# Altium schematic sheet 1_the important stuff.schdoc
size 604 x 431 mm; Symbol: Sheet-Symbol_A4; Device: Sheet-Symbol_A4; Company: Quarterpie; Drawed: Prash; Reviewed: Prash; Version: V1.2; Page Size: A4; @Project Name: URC merc keyboard; @Page Count: 2; @Update Date: 2024-08-09; @Create Date: 2023-04-20; @Schematic Name: Schematic1; Part Number: URC75; @Page No: 1; @Page Name: the important stuff
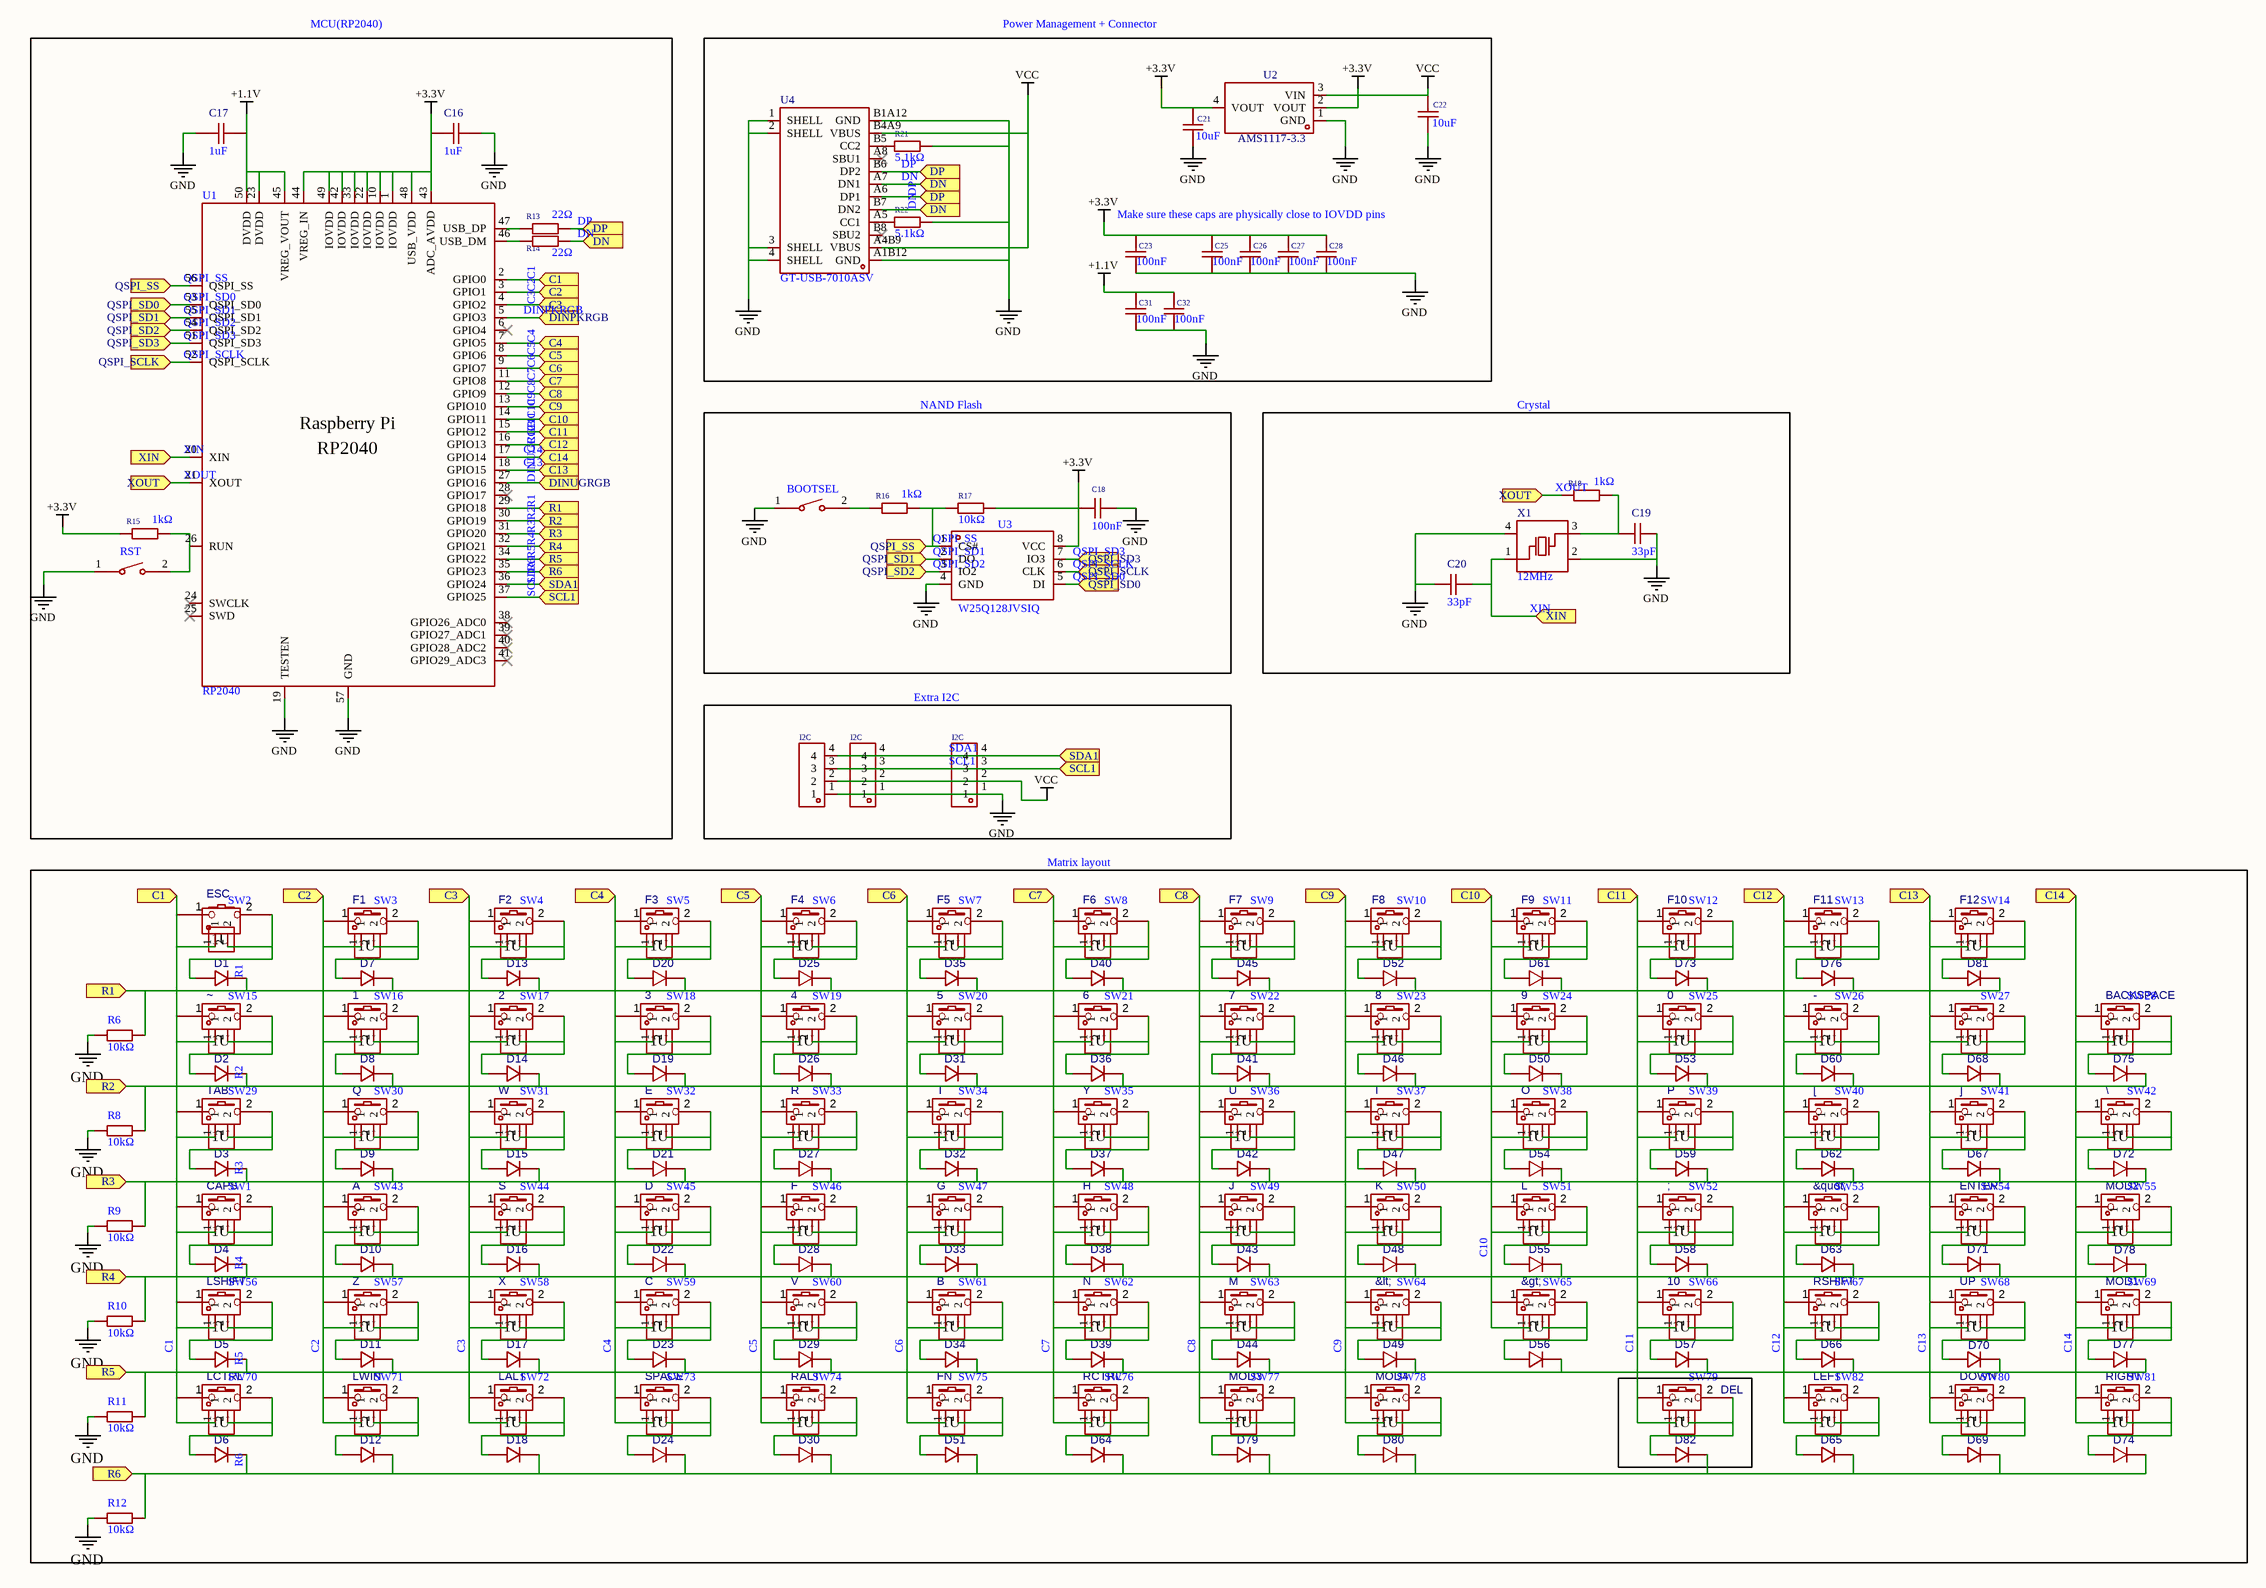
[diagram p0: 1_the important stuff.schdoc]

## Parts
(Parts that share a designator on the sheet are numbered #1, #2 ... from top to bottom, then left to right.)
0  CHERRY-MX-SW-1U  [CHERRY-MX-PCB-1U]  (value not drawn)
1  CHERRY-MX-SW-1U  [CHERRY-MX-PCB-1U]  (value not drawn)
2  CHERRY-MX-SW-1U  [CHERRY-MX-PCB-1U]  (value not drawn)
3  CHERRY-MX-SW-1U  [CHERRY-MX-PCB-1U]  (value not drawn)
4  CHERRY-MX-SW-1U  [CHERRY-MX-PCB-1U]  (value not drawn)
5  CHERRY-MX-SW-1U  [CHERRY-MX-PCB-1U]  (value not drawn)
6  CHERRY-MX-SW-1U  [CHERRY-MX-PCB-1U]  (value not drawn)
7  CHERRY-MX-SW-1U  [CHERRY-MX-PCB-1U]  (value not drawn)
8  CHERRY-MX-SW-1U  [CHERRY-MX-PCB-1U]  (value not drawn)
9  CHERRY-MX-SW-1U  [CHERRY-MX-PCB-1U]  (value not drawn)
10  CHERRY-MX-SW-1U  [CHERRY-MX-PCB-1U]  (value not drawn)
&gt;  CHERRY-MX-SW-1U  [CHERRY-MX-PCB-1U]  (value not drawn)
&lt;  CHERRY-MX-SW-1U  [CHERRY-MX-PCB-1U]  (value not drawn)
&quot;  CHERRY-MX-SW-1U  [CHERRY-MX-PCB-1U]  (value not drawn)
-  CHERRY-MX-SW-1U  [CHERRY-MX-PCB-1U]  (value not drawn)
;  CHERRY-MX-SW-1U  [CHERRY-MX-PCB-1U]  (value not drawn)
?  CHERRY-MX-SW-1U  [CHERRY-MX-PCB-1U]  (value not drawn)
[  CHERRY-MX-SW-1U  [CHERRY-MX-PCB-1U]  (value not drawn)
\  CHERRY-MX-SW-1U  [CHERRY-MX-PCB-1U]  (value not drawn)
]  CHERRY-MX-SW-1U  [CHERRY-MX-PCB-1U]  (value not drawn)
A  CHERRY-MX-SW-1U  [CHERRY-MX-PCB-1U]  (value not drawn)
B  CHERRY-MX-SW-1U  [CHERRY-MX-PCB-1U]  (value not drawn)
BACKSPACE  CHERRY-MX-SW-1U  [CHERRY-MX-PCB-1U]  (value not drawn)
BOOTSEL  TS-1088-AR02016  [SW-SMD_L3.9-W3.0-P4.45]  (value not drawn)
C  CHERRY-MX-SW-1U  [CHERRY-MX-PCB-1U]  (value not drawn)
C16  1uF  [C0402]
C17  1uF  [C0402]
C18  100nF  [C0402]
C19  33pF  [C0402]
C20  33pF  [C0402]
C21  10uF  [C0402]
C22  10uF  [C0402]
C23  100nF  [C0402]
C25  100nF  [C0402]
C26  100nF  [C0402]
C27  100nF  [C0402]
C28  100nF  [C0402]
C31  100nF  [C0402]
C32  100nF  [C0402]
CAPS  CHERRY-MX-SW-1U  [CHERRY-MX-PCB-1U]  (value not drawn)
D  CHERRY-MX-SW-1U  [CHERRY-MX-PCB-1U]  (value not drawn)
D1  1N4148_C14538  [DO-35_BD2.0-L4.2-P8.20-D0.5-RD]  (value not drawn)
D2  1N4148_C14538  [DO-35_BD2.0-L4.2-P8.20-D0.5-RD]  (value not drawn)
D3  1N4148_C14538  [DO-35_BD2.0-L4.2-P8.20-D0.5-RD]  (value not drawn)
D4  1N4148_C14538  [DO-35_BD2.0-L4.2-P8.20-D0.5-RD]  (value not drawn)
D5  1N4148_C14538  [DO-35_BD2.0-L4.2-P8.20-D0.5-RD]  (value not drawn)
D6  1N4148_C14538  [DO-35_BD2.0-L4.2-P8.20-D0.5-RD]  (value not drawn)
D7  1N4148_C14538  [DO-35_BD2.0-L4.2-P8.20-D0.5-RD]  (value not drawn)
D8  1N4148_C14538  [DO-35_BD2.0-L4.2-P8.20-D0.5-RD]  (value not drawn)
D9  1N4148_C14538  [DO-35_BD2.0-L4.2-P8.20-D0.5-RD]  (value not drawn)
D10  1N4148_C14538  [DO-35_BD2.0-L4.2-P8.20-D0.5-RD]  (value not drawn)
D11  1N4148_C14538  [DO-35_BD2.0-L4.2-P8.20-D0.5-RD]  (value not drawn)
D12  1N4148_C14538  [DO-35_BD2.0-L4.2-P8.20-D0.5-RD]  (value not drawn)
D13  1N4148_C14538  [DO-35_BD2.0-L4.2-P8.20-D0.5-RD]  (value not drawn)
D14  1N4148_C14538  [DO-35_BD2.0-L4.2-P8.20-D0.5-RD]  (value not drawn)
D15  1N4148_C14538  [DO-35_BD2.0-L4.2-P8.20-D0.5-RD]  (value not drawn)
D16  1N4148_C14538  [DO-35_BD2.0-L4.2-P8.20-D0.5-RD]  (value not drawn)
D17  1N4148_C14538  [DO-35_BD2.0-L4.2-P8.20-D0.5-RD]  (value not drawn)
D18  1N4148_C14538  [DO-35_BD2.0-L4.2-P8.20-D0.5-RD]  (value not drawn)
D19  1N4148_C14538  [DO-35_BD2.0-L4.2-P8.20-D0.5-RD]  (value not drawn)
D20  1N4148_C14538  [DO-35_BD2.0-L4.2-P8.20-D0.5-RD]  (value not drawn)
D21  1N4148_C14538  [DO-35_BD2.0-L4.2-P8.20-D0.5-RD]  (value not drawn)
D22  1N4148_C14538  [DO-35_BD2.0-L4.2-P8.20-D0.5-RD]  (value not drawn)
D23  1N4148_C14538  [DO-35_BD2.0-L4.2-P8.20-D0.5-RD]  (value not drawn)
D24  1N4148_C14538  [DO-35_BD2.0-L4.2-P8.20-D0.5-RD]  (value not drawn)
D25  1N4148_C14538  [DO-35_BD2.0-L4.2-P8.20-D0.5-RD]  (value not drawn)
D26  1N4148_C14538  [DO-35_BD2.0-L4.2-P8.20-D0.5-RD]  (value not drawn)
D27  1N4148_C14538  [DO-35_BD2.0-L4.2-P8.20-D0.5-RD]  (value not drawn)
D28  1N4148_C14538  [DO-35_BD2.0-L4.2-P8.20-D0.5-RD]  (value not drawn)
D29  1N4148_C14538  [DO-35_BD2.0-L4.2-P8.20-D0.5-RD]  (value not drawn)
D30  1N4148_C14538  [DO-35_BD2.0-L4.2-P8.20-D0.5-RD]  (value not drawn)
D31  1N4148_C14538  [DO-35_BD2.0-L4.2-P8.20-D0.5-RD]  (value not drawn)
D32  1N4148_C14538  [DO-35_BD2.0-L4.2-P8.20-D0.5-RD]  (value not drawn)
D33  1N4148_C14538  [DO-35_BD2.0-L4.2-P8.20-D0.5-RD]  (value not drawn)
D34  1N4148_C14538  [DO-35_BD2.0-L4.2-P8.20-D0.5-RD]  (value not drawn)
D35  1N4148_C14538  [DO-35_BD2.0-L4.2-P8.20-D0.5-RD]  (value not drawn)
D36  1N4148_C14538  [DO-35_BD2.0-L4.2-P8.20-D0.5-RD]  (value not drawn)
D37  1N4148_C14538  [DO-35_BD2.0-L4.2-P8.20-D0.5-RD]  (value not drawn)
D38  1N4148_C14538  [DO-35_BD2.0-L4.2-P8.20-D0.5-RD]  (value not drawn)
D39  1N4148_C14538  [DO-35_BD2.0-L4.2-P8.20-D0.5-RD]  (value not drawn)
D40  1N4148_C14538  [DO-35_BD2.0-L4.2-P8.20-D0.5-RD]  (value not drawn)
D41  1N4148_C14538  [DO-35_BD2.0-L4.2-P8.20-D0.5-RD]  (value not drawn)
D42  1N4148_C14538  [DO-35_BD2.0-L4.2-P8.20-D0.5-RD]  (value not drawn)
D43  1N4148_C14538  [DO-35_BD2.0-L4.2-P8.20-D0.5-RD]  (value not drawn)
D44  1N4148_C14538  [DO-35_BD2.0-L4.2-P8.20-D0.5-RD]  (value not drawn)
D45  1N4148_C14538  [DO-35_BD2.0-L4.2-P8.20-D0.5-RD]  (value not drawn)
D46  1N4148_C14538  [DO-35_BD2.0-L4.2-P8.20-D0.5-RD]  (value not drawn)
D47  1N4148_C14538  [DO-35_BD2.0-L4.2-P8.20-D0.5-RD]  (value not drawn)
D48  1N4148_C14538  [DO-35_BD2.0-L4.2-P8.20-D0.5-RD]  (value not drawn)
D49  1N4148_C14538  [DO-35_BD2.0-L4.2-P8.20-D0.5-RD]  (value not drawn)
D50  1N4148_C14538  [DO-35_BD2.0-L4.2-P8.20-D0.5-RD]  (value not drawn)
D51  1N4148_C14538  [DO-35_BD2.0-L4.2-P8.20-D0.5-RD]  (value not drawn)
D52  1N4148_C14538  [DO-35_BD2.0-L4.2-P8.20-D0.5-RD]  (value not drawn)
D53  1N4148_C14538  [DO-35_BD2.0-L4.2-P8.20-D0.5-RD]  (value not drawn)
D54  1N4148_C14538  [DO-35_BD2.0-L4.2-P8.20-D0.5-RD]  (value not drawn)
D55  1N4148_C14538  [DO-35_BD2.0-L4.2-P8.20-D0.5-RD]  (value not drawn)
D56  1N4148_C14538  [DO-35_BD2.0-L4.2-P8.20-D0.5-RD]  (value not drawn)
D57  1N4148_C14538  [DO-35_BD2.0-L4.2-P8.20-D0.5-RD]  (value not drawn)
D58  1N4148_C14538  [DO-35_BD2.0-L4.2-P8.20-D0.5-RD]  (value not drawn)
D59  1N4148_C14538  [DO-35_BD2.0-L4.2-P8.20-D0.5-RD]  (value not drawn)
D60  1N4148_C14538  [DO-35_BD2.0-L4.2-P8.20-D0.5-RD]  (value not drawn)
D61  1N4148_C14538  [DO-35_BD2.0-L4.2-P8.20-D0.5-RD]  (value not drawn)
D62  1N4148_C14538  [DO-35_BD2.0-L4.2-P8.20-D0.5-RD]  (value not drawn)
D63  1N4148_C14538  [DO-35_BD2.0-L4.2-P8.20-D0.5-RD]  (value not drawn)
D64  1N4148_C14538  [DO-35_BD2.0-L4.2-P8.20-D0.5-RD]  (value not drawn)
D65  1N4148_C14538  [DO-35_BD2.0-L4.2-P8.20-D0.5-RD]  (value not drawn)
D66  1N4148_C14538  [DO-35_BD2.0-L4.2-P8.20-D0.5-RD]  (value not drawn)
D67  1N4148_C14538  [DO-35_BD2.0-L4.2-P8.20-D0.5-RD]  (value not drawn)
D68  1N4148_C14538  [DO-35_BD2.0-L4.2-P8.20-D0.5-RD]  (value not drawn)
D69  1N4148_C14538  [DO-35_BD2.0-L4.2-P8.20-D0.5-RD]  (value not drawn)
D70  1N4148_C14538  [DO-35_BD2.0-L4.2-P8.20-D0.5-RD]  (value not drawn)
D71  1N4148_C14538  [DO-35_BD2.0-L4.2-P8.20-D0.5-RD]  (value not drawn)
D72  1N4148_C14538  [DO-35_BD2.0-L4.2-P8.20-D0.5-RD]  (value not drawn)
D73  1N4148_C14538  [DO-35_BD2.0-L4.2-P8.20-D0.5-RD]  (value not drawn)
D74  1N4148_C14538  [DO-35_BD2.0-L4.2-P8.20-D0.5-RD]  (value not drawn)
D75  1N4148_C14538  [DO-35_BD2.0-L4.2-P8.20-D0.5-RD]  (value not drawn)
D76  1N4148_C14538  [DO-35_BD2.0-L4.2-P8.20-D0.5-RD]  (value not drawn)
D77  1N4148_C14538  [DO-35_BD2.0-L4.2-P8.20-D0.5-RD]  (value not drawn)
D78  1N4148_C14538  [DO-35_BD2.0-L4.2-P8.20-D0.5-RD]  (value not drawn)
D79  1N4148_C14538  [DO-35_BD2.0-L4.2-P8.20-D0.5-RD]  (value not drawn)
D80  1N4148_C14538  [DO-35_BD2.0-L4.2-P8.20-D0.5-RD]  (value not drawn)
D81  1N4148_C14538  [DO-35_BD2.0-L4.2-P8.20-D0.5-RD]  (value not drawn)
D82  1N4148_C14538  [DO-35_BD2.0-L4.2-P8.20-D0.5-RD]  (value not drawn)
DEL  CHERRY-MX-SW-1U  [CHERRY-MX-PCB-1U]  (value not drawn)
DOWN  CHERRY-MX-SW-1U  [CHERRY-MX-PCB-1U]  (value not drawn)
E  CHERRY-MX-SW-1U  [CHERRY-MX-PCB-1U]  (value not drawn)
ENTER  CHERRY-MX-SW-1U  [CHERRY-MX-PCB-1U]  (value not drawn)
ESC  CHERRY-MX-SW-1U  [CHERRY-MX-PCB-1U]  (value not drawn)
F  CHERRY-MX-SW-1U  [CHERRY-MX-PCB-1U]  (value not drawn)
F1  CHERRY-MX-SW-1U  [CHERRY-MX-PCB-1U]  (value not drawn)
F2  CHERRY-MX-SW-1U  [CHERRY-MX-PCB-1U]  (value not drawn)
F3  CHERRY-MX-SW-1U  [CHERRY-MX-PCB-1U]  (value not drawn)
F4  CHERRY-MX-SW-1U  [CHERRY-MX-PCB-1U]  (value not drawn)
F5  CHERRY-MX-SW-1U  [CHERRY-MX-PCB-1U]  (value not drawn)
F6  CHERRY-MX-SW-1U  [CHERRY-MX-PCB-1U]  (value not drawn)
F7  CHERRY-MX-SW-1U  [CHERRY-MX-PCB-1U]  (value not drawn)
F8  CHERRY-MX-SW-1U  [CHERRY-MX-PCB-1U]  (value not drawn)
F9  CHERRY-MX-SW-1U  [CHERRY-MX-PCB-1U]  (value not drawn)
F10  CHERRY-MX-SW-1U  [CHERRY-MX-PCB-1U]  (value not drawn)
F11  CHERRY-MX-SW-1U  [CHERRY-MX-PCB-1U]  (value not drawn)
F12  CHERRY-MX-SW-1U  [CHERRY-MX-PCB-1U]  (value not drawn)
FN  CHERRY-MX-SW-1U  [CHERRY-MX-PCB-1U]  (value not drawn)
G  CHERRY-MX-SW-1U  [CHERRY-MX-PCB-1U]  (value not drawn)
H  CHERRY-MX-SW-1U  [CHERRY-MX-PCB-1U]  (value not drawn)
I  CHERRY-MX-SW-1U  [CHERRY-MX-PCB-1U]  (value not drawn)
I2C#1  PZ254V-11-04P  [HDR-TH_4P-P2.54-V-M]  (value not drawn)
I2C#2  PZ254V-11-04P  [HDR-TH_4P-P2.54-V-M]  (value not drawn)
I2C#3  PZ254V-11-04P  [HDR-TH_4P-P2.54-V-M]  (value not drawn)
J  CHERRY-MX-SW-1U  [CHERRY-MX-PCB-1U]  (value not drawn)
K  CHERRY-MX-SW-1U  [CHERRY-MX-PCB-1U]  (value not drawn)
L  CHERRY-MX-SW-1U  [CHERRY-MX-PCB-1U]  (value not drawn)
LALT  CHERRY-MX-SW-1U  [CHERRY-MX-PCB-1U]  (value not drawn)
LCTRL  CHERRY-MX-SW-1U  [CHERRY-MX-PCB-1U]  (value not drawn)
LEFT  CHERRY-MX-SW-1U  [CHERRY-MX-PCB-1U]  (value not drawn)
LSHIFT  CHERRY-MX-SW-1U  [CHERRY-MX-PCB-1U]  (value not drawn)
LWIN  CHERRY-MX-SW-1U  [CHERRY-MX-PCB-1U]  (value not drawn)
M  CHERRY-MX-SW-1U  [CHERRY-MX-PCB-1U]  (value not drawn)
MOD1  CHERRY-MX-SW-1U  [CHERRY-MX-PCB-1U]  (value not drawn)
MOD2  CHERRY-MX-SW-1U  [CHERRY-MX-PCB-1U]  (value not drawn)
MOD3  CHERRY-MX-SW-1U  [CHERRY-MX-PCB-1U]  (value not drawn)
MOD4  CHERRY-MX-SW-1U  [CHERRY-MX-PCB-1U]  (value not drawn)
N  CHERRY-MX-SW-1U  [CHERRY-MX-PCB-1U]  (value not drawn)
O  CHERRY-MX-SW-1U  [CHERRY-MX-PCB-1U]  (value not drawn)
P  CHERRY-MX-SW-1U  [CHERRY-MX-PCB-1U]  (value not drawn)
Q  CHERRY-MX-SW-1U  [CHERRY-MX-PCB-1U]  (value not drawn)
R  CHERRY-MX-SW-1U  [CHERRY-MX-PCB-1U]  (value not drawn)
R6  10kΩ  [R0603]
R8  10kΩ  [R0603]
R9  10kΩ  [R0603]
R10  10kΩ  [R0603]
R11  10kΩ  [R0603]
R12  10kΩ  [R0603]
R13  22Ω  [R0402]
R14  22Ω  [R0402]
R15  1kΩ  [R0402]
R16  1kΩ  [R0402]
R17  10kΩ  [R0402]
R18  1kΩ  [R0402]
R21  5.1kΩ  [R0402]
R22  5.1kΩ  [R0402]
RALT  CHERRY-MX-SW-1U  [CHERRY-MX-PCB-1U]  (value not drawn)
RCTRL  CHERRY-MX-SW-1U  [CHERRY-MX-PCB-1U]  (value not drawn)
RIGHT  CHERRY-MX-SW-1U  [CHERRY-MX-PCB-1U]  (value not drawn)
RSHIFT  CHERRY-MX-SW-1U  [CHERRY-MX-PCB-1U]  (value not drawn)
RST  TS-1088-AR02016  [SW-SMD_L3.9-W3.0-P4.45]  (value not drawn)
S  CHERRY-MX-SW-1U  [CHERRY-MX-PCB-1U]  (value not drawn)
SPACE  CHERRY-MX-SW-1U  [CHERRY-MX-PCB-1U]  (value not drawn)
SW1  SW-5  [SW-SMD_KAILH-SOCKET_C9900019772]  (value not drawn)
SW2  SW-5  [SW-SMD_KAILH-SOCKET_C9900019772]  (value not drawn)
SW3  SW-5  [SW-SMD_KAILH-SOCKET_C9900019772]  (value not drawn)
SW4  SW-5  [SW-SMD_KAILH-SOCKET_C9900019772]  (value not drawn)
SW5  SW-5  [SW-SMD_KAILH-SOCKET_C9900019772]  (value not drawn)
SW6  SW-5  [SW-SMD_KAILH-SOCKET_C9900019772]  (value not drawn)
SW7  SW-5  [SW-SMD_KAILH-SOCKET_C9900019772]  (value not drawn)
SW8  SW-5  [SW-SMD_KAILH-SOCKET_C9900019772]  (value not drawn)
SW9  SW-5  [SW-SMD_KAILH-SOCKET_C9900019772]  (value not drawn)
SW10  SW-5  [SW-SMD_KAILH-SOCKET_C9900019772]  (value not drawn)
SW11  SW-5  [SW-SMD_KAILH-SOCKET_C9900019772]  (value not drawn)
SW12  SW-5  [SW-SMD_KAILH-SOCKET_C9900019772]  (value not drawn)
SW13  SW-5  [SW-SMD_KAILH-SOCKET_C9900019772]  (value not drawn)
SW14  SW-5  [SW-SMD_KAILH-SOCKET_C9900019772]  (value not drawn)
SW15  SW-5  [SW-SMD_KAILH-SOCKET_C9900019772]  (value not drawn)
SW16  SW-5  [SW-SMD_KAILH-SOCKET_C9900019772]  (value not drawn)
SW17  SW-5  [SW-SMD_KAILH-SOCKET_C9900019772]  (value not drawn)
SW18  SW-5  [SW-SMD_KAILH-SOCKET_C9900019772]  (value not drawn)
SW19  SW-5  [SW-SMD_KAILH-SOCKET_C9900019772]  (value not drawn)
SW20  SW-5  [SW-SMD_KAILH-SOCKET_C9900019772]  (value not drawn)
SW21  SW-5  [SW-SMD_KAILH-SOCKET_C9900019772]  (value not drawn)
SW22  SW-5  [SW-SMD_KAILH-SOCKET_C9900019772]  (value not drawn)
SW23  SW-5  [SW-SMD_KAILH-SOCKET_C9900019772]  (value not drawn)
SW24  SW-5  [SW-SMD_KAILH-SOCKET_C9900019772]  (value not drawn)
SW25  SW-5  [SW-SMD_KAILH-SOCKET_C9900019772]  (value not drawn)
SW26  SW-5  [SW-SMD_KAILH-SOCKET_C9900019772]  (value not drawn)
SW27  SW-5  [SW-SMD_KAILH-SOCKET_C9900019772]  (value not drawn)
SW28  SW-5  [SW-SMD_KAILH-SOCKET_C9900019772]  (value not drawn)
SW29  SW-5  [SW-SMD_KAILH-SOCKET_C9900019772]  (value not drawn)
SW30  SW-5  [SW-SMD_KAILH-SOCKET_C9900019772]  (value not drawn)
SW31  SW-5  [SW-SMD_KAILH-SOCKET_C9900019772]  (value not drawn)
SW32  SW-5  [SW-SMD_KAILH-SOCKET_C9900019772]  (value not drawn)
SW33  SW-5  [SW-SMD_KAILH-SOCKET_C9900019772]  (value not drawn)
SW34  SW-5  [SW-SMD_KAILH-SOCKET_C9900019772]  (value not drawn)
SW35  SW-5  [SW-SMD_KAILH-SOCKET_C9900019772]  (value not drawn)
SW36  SW-5  [SW-SMD_KAILH-SOCKET_C9900019772]  (value not drawn)
SW37  SW-5  [SW-SMD_KAILH-SOCKET_C9900019772]  (value not drawn)
SW38  SW-5  [SW-SMD_KAILH-SOCKET_C9900019772]  (value not drawn)
SW39  SW-5  [SW-SMD_KAILH-SOCKET_C9900019772]  (value not drawn)
SW40  SW-5  [SW-SMD_KAILH-SOCKET_C9900019772]  (value not drawn)
SW41  SW-5  [SW-SMD_KAILH-SOCKET_C9900019772]  (value not drawn)
SW42  SW-5  [SW-SMD_KAILH-SOCKET_C9900019772]  (value not drawn)
SW43  SW-5  [SW-SMD_KAILH-SOCKET_C9900019772]  (value not drawn)
SW44  SW-5  [SW-SMD_KAILH-SOCKET_C9900019772]  (value not drawn)
SW45  SW-5  [SW-SMD_KAILH-SOCKET_C9900019772]  (value not drawn)
SW46  SW-5  [SW-SMD_KAILH-SOCKET_C9900019772]  (value not drawn)
SW47  SW-5  [SW-SMD_KAILH-SOCKET_C9900019772]  (value not drawn)
SW48  SW-5  [SW-SMD_KAILH-SOCKET_C9900019772]  (value not drawn)
SW49  SW-5  [SW-SMD_KAILH-SOCKET_C9900019772]  (value not drawn)
SW50  SW-5  [SW-SMD_KAILH-SOCKET_C9900019772]  (value not drawn)
SW51  SW-5  [SW-SMD_KAILH-SOCKET_C9900019772]  (value not drawn)
SW52  SW-5  [SW-SMD_KAILH-SOCKET_C9900019772]  (value not drawn)
SW53  SW-5  [SW-SMD_KAILH-SOCKET_C9900019772]  (value not drawn)
SW54  SW-5  [SW-SMD_KAILH-SOCKET_C9900019772]  (value not drawn)
SW55  SW-5  [SW-SMD_KAILH-SOCKET_C9900019772]  (value not drawn)
SW56  SW-5  [SW-SMD_KAILH-SOCKET_C9900019772]  (value not drawn)
SW57  SW-5  [SW-SMD_KAILH-SOCKET_C9900019772]  (value not drawn)
SW58  SW-5  [SW-SMD_KAILH-SOCKET_C9900019772]  (value not drawn)
SW59  SW-5  [SW-SMD_KAILH-SOCKET_C9900019772]  (value not drawn)
SW60  SW-5  [SW-SMD_KAILH-SOCKET_C9900019772]  (value not drawn)
SW61  SW-5  [SW-SMD_KAILH-SOCKET_C9900019772]  (value not drawn)
SW62  SW-5  [SW-SMD_KAILH-SOCKET_C9900019772]  (value not drawn)
SW63  SW-5  [SW-SMD_KAILH-SOCKET_C9900019772]  (value not drawn)
SW64  SW-5  [SW-SMD_KAILH-SOCKET_C9900019772]  (value not drawn)
SW65  SW-5  [SW-SMD_KAILH-SOCKET_C9900019772]  (value not drawn)
SW66  SW-5  [SW-SMD_KAILH-SOCKET_C9900019772]  (value not drawn)
SW67  SW-5  [SW-SMD_KAILH-SOCKET_C9900019772]  (value not drawn)
SW68  SW-5  [SW-SMD_KAILH-SOCKET_C9900019772]  (value not drawn)
SW69  SW-5  [SW-SMD_KAILH-SOCKET_C9900019772]  (value not drawn)
SW70  SW-5  [SW-SMD_KAILH-SOCKET_C9900019772]  (value not drawn)
SW71  SW-5  [SW-SMD_KAILH-SOCKET_C9900019772]  (value not drawn)
SW72  SW-5  [SW-SMD_KAILH-SOCKET_C9900019772]  (value not drawn)
SW73  SW-5  [SW-SMD_KAILH-SOCKET_C9900019772]  (value not drawn)
SW74  SW-5  [SW-SMD_KAILH-SOCKET_C9900019772]  (value not drawn)
SW75  SW-5  [SW-SMD_KAILH-SOCKET_C9900019772]  (value not drawn)
SW76  SW-5  [SW-SMD_KAILH-SOCKET_C9900019772]  (value not drawn)
SW77  SW-5  [SW-SMD_KAILH-SOCKET_C9900019772]  (value not drawn)
SW78  SW-5  [SW-SMD_KAILH-SOCKET_C9900019772]  (value not drawn)
SW79  SW-5  [SW-SMD_KAILH-SOCKET_C9900019772]  (value not drawn)
SW80  SW-5  [SW-SMD_KAILH-SOCKET_C9900019772]  (value not drawn)
SW81  SW-5  [SW-SMD_KAILH-SOCKET_C9900019772]  (value not drawn)
SW82  SW-5  [SW-SMD_KAILH-SOCKET_C9900019772]  (value not drawn)
T  CHERRY-MX-SW-1U  [CHERRY-MX-PCB-1U]  (value not drawn)
TAB  CHERRY-MX-SW-1U  [CHERRY-MX-PCB-1U]  (value not drawn)
U  CHERRY-MX-SW-1U  [CHERRY-MX-PCB-1U]  (value not drawn)
U1  RP2040  [LQFN-56_L7.0-W7.0-P0.4-EP]
U2  AMS1117-3.3  [SOT-223-3_L6.5-W3.4-P2.30-LS7.0-BR]
U3  W25Q128JVSIQ  [SOIC-8_L5.3-W5.3-P1.27-LS8.0-BL]
U4  GT-USB-7010ASV  [USB-C-SMD_G-SWITCH_GT-USB-7010ASV]
UP  CHERRY-MX-SW-1U  [CHERRY-MX-PCB-1U]  (value not drawn)
V  CHERRY-MX-SW-1U  [CHERRY-MX-PCB-1U]  (value not drawn)
W  CHERRY-MX-SW-1U  [CHERRY-MX-PCB-1U]  (value not drawn)
X  CHERRY-MX-SW-1U  [CHERRY-MX-PCB-1U]  (value not drawn)
X1  12MHz  [OSC-SMD_4P-L3.2-W2.5-BL]
Y  CHERRY-MX-SW-1U  [CHERRY-MX-PCB-1U]  (value not drawn)
Z  CHERRY-MX-SW-1U  [CHERRY-MX-PCB-1U]  (value not drawn)
~  CHERRY-MX-SW-1U  [CHERRY-MX-PCB-1U]  (value not drawn)

## Blocks framed on the sheet
MCU(RP2040): C16 C17 R13-R15 RST U1
NAND Flash: BOOTSEL C18 R16 R17 U3
Crystal: C19 C20 R18 X1
Extra I2C: I2C#1-I2C#3
Matrix layout: 0-10 &gt; &lt; &quot; - ; ? [ \ ] A B BACKSPACE C CAPS D D1-D82 DEL DOWN E ENTER ESC F F1-F12 FN G H I J K L LALT LCTRL LEFT LSHIFT LWIN M MOD1-MOD4 N O P Q R R6 R8-R12 RALT RCTRL RIGHT RSHIFT S SPACE SW1-SW82 T TAB U UP V W X Y Z ~

## Ports
C1 (in), C2 (in), C3 (in), C4 (in), C5 (in), C6 (in), C7 (in), C8 (in), C9 (in), C10 (in), C11 (in), C12 (in), C13 (in), C14 (in), DINPKRGB (in), DINUGRGB (in), DN (in), DP (in), QSPI_SCLK (in), QSPI_SD0 (in), QSPI_SD1 (in), QSPI_SD2 (in), QSPI_SD3 (in), QSPI_SS (in), R1 (in), R2 (in), R3 (in), R4 (in), R5 (in), R6 (in), SCL1 (in), SDA1 (in), XIN (in), XOUT (in)

## Nets
+1.1V: C17.2 C31.2 C32.2 U1.23(DVDD) U1.45(VREG_VOUT) U1.50(DVDD)
+3.3V: C16.1 C18.1 C21.2 C23.2 C25.2 C26.2 C27.2 C28.2 R15.1 R17.2 U1.1(IOVDD) U1.10(IOVDD) U1.22(IOVDD) U1.33(IOVDD) U1.42(IOVDD) U1.43(ADC_AVDD) U1.44(VREG_IN) U1.48(USB_VDD) U1.49(IOVDD) U2.2(VOUT) U2.4(VOUT) U3.8(VCC)
GND: BOOTSEL.1 C16.2 C17.1 C18.2 C19.2 C20.1 C21.1 C22.1 C23.1 C25.1 C26.1 C27.1 C28.1 C31.1 C32.1 I2C#1.1 I2C#2.1 I2C#3.1 R6.1 R8.1 R9.1 R10.1 R11.1 R12.1 R21.1 R22.1 RST.1 U1.19(TESTEN) U1.57(GND) U2.1(GND) U3.4(GND) U4.1(SHELL) U4.2(SHELL) U4.3(SHELL) U4.4(SHELL) U4.A1B12(GND) U4.B1A12(GND) X1.2(GND) X1.4(GND)
VCC: C22.2 I2C#1.2 I2C#2.2 I2C#3.2 U2.3(VIN) U4.A4B9(VBUS) U4.B4A9(VBUS)
C1: CAPS.1(col) ESC.1(col) LCTRL.1(col) LSHIFT.1(col) SW1.1 SW2.1 SW15.1 SW29.1 SW56.1 SW70.1 TAB.1(col) U1.2(GPIO0) ~.1(col) ; port C1
C2: 1.1(col) A.1(col) F1.1(col) LWIN.1(col) Q.1(col) SW3.1 SW16.1 SW30.1 SW43.1 SW57.1 SW71.1 U1.3(GPIO1) Z.1(col) ; port C2
C3: 2.1(col) F2.1(col) LALT.1(col) S.1(col) SW4.1 SW17.1 SW31.1 SW44.1 SW58.1 SW72.1 U1.4(GPIO2) W.1(col) X.1(col) ; port C3
C4: 3.1(col) C.1(col) D.1(col) E.1(col) F3.1(col) SPACE.1(col) SW5.1 SW18.1 SW32.1 SW45.1 SW59.1 SW73.1 U1.7(GPIO5) ; port C4
C5: 4.1(col) F.1(col) F4.1(col) R.1(col) RALT.1(col) SW6.1 SW19.1 SW33.1 SW46.1 SW60.1 SW74.1 U1.8(GPIO6) V.1(col) ; port C5
C6: 5.1(col) B.1(col) F5.1(col) FN.1(col) G.1(col) SW7.1 SW20.1 SW34.1 SW47.1 SW61.1 SW75.1 T.1(col) U1.9(GPIO7) ; port C6
C7: 6.1(col) F6.1(col) H.1(col) N.1(col) RCTRL.1(col) SW8.1 SW21.1 SW35.1 SW48.1 SW62.1 SW76.1 U1.11(GPIO8) Y.1(col) ; port C7
C8: 7.1(col) F7.1(col) J.1(col) M.1(col) MOD3.1(col) SW9.1 SW22.1 SW36.1 SW49.1 SW63.1 SW77.1 U.1(col) U1.12(GPIO9) ; port C8
C9: 8.1(col) &lt;.1(col) F8.1(col) I.1(col) K.1(col) MOD4.1(col) SW10.1 SW23.1 SW37.1 SW50.1 SW64.1 SW78.1 U1.13(GPIO10) ; port C9
C10: 9.1(col) &gt;.1(col) F9.1(col) L.1(col) O.1(col) SW11.1 SW24.1 SW38.1 SW51.1 SW65.1 U1.14(GPIO11) ; port C10
C11: 0.1(col) 10.1(col) ;.1(col) DEL.1(col) F10.1(col) P.1(col) SW12.1 SW25.1 SW39.1 SW52.1 SW66.1 SW79.1 U1.15(GPIO12) ; port C11
C12: &quot;.1(col) -.1(col) [.1(col) F11.1(col) LEFT.1(col) RSHIFT.1(col) SW13.1 SW26.1 SW40.1 SW53.1 SW67.1 SW82.1 U1.16(GPIO13) ; port C12
C13: ?.1(col) ].1(col) DOWN.1(col) ENTER.1(col) F12.1(col) SW14.1 SW27.1 SW41.1 SW54.1 SW68.1 SW80.1 U1.18(GPIO15) UP.1(col) ; port C13
C14: \.1(col) BACKSPACE.1(col) MOD1.1(col) MOD2.1(col) RIGHT.1(col) SW28.1 SW42.1 SW55.1 SW69.1 SW81.1 U1.17(GPIO14) ; port C14
DINPKRGB: U1.5(GPIO3) ; port DINPKRGB
DINUGRGB: U1.27(GPIO16) ; port DINUGRGB
DN: R14.2 U4.A7(DN1) U4.B7(DN2) ; port DN
DP: R13.2 U4.A6(DP1) U4.B6(DP2) ; port DP
QSPI_SCLK: U1.52(QSPI_SCLK) U3.6(CLK) ; port QSPI_SCLK
QSPI_SD0: U1.53(QSPI_SD0) U3.5(DI) ; port QSPI_SD0
QSPI_SD1: U1.55(QSPI_SD1) U3.2(DO) ; port QSPI_SD1
QSPI_SD2: U1.54(QSPI_SD2) U3.3(IO2) ; port QSPI_SD2
QSPI_SD3: U1.51(QSPI_SD3) U3.7(IO3) ; port QSPI_SD3
QSPI_SS: R16.2 R17.1 U1.56(QSPI_SS) U3.1(CS#) ; port QSPI_SS
R1: D1.1 D7.1 D13.1 D20.1 D25.1 D35.1 D40.1 D45.1 D52.1 D61.1 D73.1 D76.1 D81.1 R6.2 U1.29(GPIO18) ; port R1
R2: D2.1 D8.1 D14.1 D19.1 D26.1 D31.1 D36.1 D41.1 D46.1 D50.1 D53.1 D60.1 D68.1 D75.1 R8.2 U1.30(GPIO19) ; port R2
R3: D3.1 D9.1 D15.1 D21.1 D27.1 D32.1 D37.1 D42.1 D47.1 D54.1 D59.1 D62.1 D67.1 D72.1 R9.2 U1.31(GPIO20) ; port R3
R4: D4.1 D10.1 D16.1 D22.1 D28.1 D33.1 D38.1 D43.1 D48.1 D55.1 D58.1 D63.1 D71.1 D78.1 R10.2 U1.32(GPIO21) ; port R4
R5: D5.1 D11.1 D17.1 D23.1 D29.1 D34.1 D39.1 D44.1 D49.1 D56.1 D57.1 D66.1 D70.1 D77.1 R11.2 U1.34(GPIO22) ; port R5
R6: D6.1 D12.1 D18.1 D24.1 D30.1 D51.1 D64.1 D65.1 D69.1 D74.1 D79.1 D80.1 D82.1 R12.2 U1.35(GPIO23) ; port R6
SCL1: I2C#1.3 I2C#2.3 I2C#3.3 U1.37(GPIO25) ; port SCL1
SDA1: I2C#1.4 I2C#2.4 I2C#3.4 U1.36(GPIO24) ; port SDA1
XIN: C20.2 U1.20(XIN) X1.1(OSC1) ; port XIN
XOUT: R18.1 U1.21(XOUT) ; port XOUT
Net0_2: 0.2(row) D53.2 SW25.2
Net1_2: 1.2(row) D8.2 SW16.2
Net2_2: 2.2(row) D14.2 SW17.2
Net3_2: 3.2(row) D19.2 SW18.2
Net4_2: 4.2(row) D26.2 SW19.2
Net5_2: 5.2(row) D31.2 SW20.2
Net6_2: 6.2(row) D36.2 SW21.2
Net7_2: 7.2(row) D41.2 SW22.2
Net8_2: 8.2(row) D46.2 SW23.2
Net9_2: 9.2(row) D50.2 SW24.2
Net10_2: 10.2(row) D57.2 SW66.2
Net&gt;_2: &gt;.2(row) D56.2 SW65.2
Net&lt;_2: &lt;.2(row) D49.2 SW64.2
Net&quot;_2: &quot;.2(row) D63.2 SW53.2
Net-_2: -.2(row) D60.2 SW26.2
Net;_2: ;.2(row) D58.2 SW52.2
Net?_2: ?.2(row) D68.2 SW27.2
Net[_2: [.2(row) D62.2 SW40.2
Ne~{t}_2: \.2(row) D72.2 SW42.2
Net]_2: ].2(row) D67.2 SW41.2
NetA_2: A.2(row) D10.2 SW43.2
NetB_2: B.2(row) D34.2 SW61.2
NetBACKSPACE_2: BACKSPACE.2(row) D75.2 SW28.2
NetBOOTSEL_2: BOOTSEL.2 R16.1
NetC19_1: C19.1 R18.2 X1.3(OSC2)
NetC_2: C.2(row) D23.2 SW59.2
NetCAPS_2: CAPS.2(row) D4.2 SW1.2
NetD1_2: D1.2 ESC.2(row) SW2.2
NetD2_2: D2.2 SW15.2 ~.2(row)
NetD3_2: D3.2 SW29.2 TAB.2(row)
NetD5_2: D5.2 LSHIFT.2(row) SW56.2
NetD6_2: D6.2 LCTRL.2(row) SW70.2
NetD7_2: D7.2 F1.2(row) SW3.2
NetD9_2: D9.2 Q.2(row) SW30.2
NetD11_2: D11.2 SW57.2 Z.2(row)
NetD12_2: D12.2 LWIN.2(row) SW71.2
NetD13_2: D13.2 F2.2(row) SW4.2
NetD15_2: D15.2 SW31.2 W.2(row)
NetD16_2: D16.2 S.2(row) SW44.2
NetD17_2: D17.2 SW58.2 X.2(row)
NetD18_2: D18.2 LALT.2(row) SW72.2
NetD20_2: D20.2 F3.2(row) SW5.2
NetD21_2: D21.2 E.2(row) SW32.2
NetD24_2: D24.2 SPACE.2(row) SW73.2
NetD25_2: D25.2 F4.2(row) SW6.2
NetD27_2: D27.2 R.2(row) SW33.2
NetD28_2: D28.2 F.2(row) SW46.2
NetD29_2: D29.2 SW60.2 V.2(row)
NetD30_2: D30.2 RALT.2(row) SW74.2
NetD32_2: D32.2 SW34.2 T.2(row)
NetD33_2: D33.2 G.2(row) SW47.2
NetD35_2: D35.2 F5.2(row) SW7.2
NetD37_2: D37.2 SW35.2 Y.2(row)
NetD38_2: D38.2 H.2(row) SW48.2
NetD39_2: D39.2 N.2(row) SW62.2
NetD40_2: D40.2 F6.2(row) SW8.2
NetD42_2: D42.2 SW36.2 U.2(row)
NetD43_2: D43.2 J.2(row) SW49.2
NetD44_2: D44.2 M.2(row) SW63.2
NetD45_2: D45.2 F7.2(row) SW9.2
NetD47_2: D47.2 I.2(row) SW37.2
NetD48_2: D48.2 K.2(row) SW50.2
NetD51_2: D51.2 FN.2(row) SW75.2
NetD52_2: D52.2 F8.2(row) SW10.2
NetD54_2: D54.2 O.2(row) SW38.2
NetD55_2: D55.2 L.2(row) SW51.2
NetD59_2: D59.2 P.2(row) SW39.2
NetD61_2: D61.2 F9.2(row) SW11.2
NetD64_2: D64.2 RCTRL.2(row) SW76.2
NetD65_2: D65.2 LEFT.2(row) SW82.2
NetD66_2: D66.2 RSHIFT.2(row) SW67.2
NetD69_2: D69.2 DOWN.2(row) SW80.2
NetD70_2: D70.2 SW68.2 UP.2(row)
NetD71_2: D71.2 ENTER.2(row) SW54.2
NetD73_2: D73.2 F10.2(row) SW12.2
NetD74_2: D74.2 RIGHT.2(row) SW81.2
NetD76_2: D76.2 F11.2(row) SW13.2
NetD77_2: D77.2 MOD1.2(row) SW69.2
NetD78_2: D78.2 MOD2.2(row) SW55.2
NetD79_2: D79.2 MOD3.2(row) SW77.2
NetD80_2: D80.2 MOD4.2(row) SW78.2
NetD81_2: D81.2 F12.2(row) SW14.2
NetD82_2: D82.2 DEL.2(row) SW79.2
NetD_2: D.2(row) D22.2 SW45.2
NetR13_1: R13.1 U1.47(USB_DP)
NetR14_1: R14.1 U1.46(USB_DM)
NetR15_2: R15.2 RST.2 U1.26(RUN)
NetR21_2: R21.2 U4.B5(CC2)
NetR22_2: R22.2 U4.A5(CC1)

Not connected (* = marked no-connect by the designer): U1 6(GPIO4)* 24(SWCLK)* 25(SWD)* 28(GPIO17)* 38(GPIO26_ADC0)* 39(GPIO27_ADC1)* 40(GPIO28_ADC2)* 41(GPIO29_ADC3)*; U4 A8(SBU1)* B8(SBU2)*

## Notes on the sheet
- Power Management + Connector
- Make sure these caps are physically close to IOVDD pins
- 1
- 2
- 3
- 4
- 5
- 6
- A
- B
- C
- D
- Schematic
- Schematic1
- Create Date
- Update Date
- 2024-08-09
- 2023-04-20
- Reviewed
- Drawed
- Page
- Prash
- the important stuff
- Part Number
- URC merc keyboard
- URC75
- VER
- SIZE
- PAGE
- OF
- V1.2
- A4
- (in symbol CHERRY-MX-SW-1U) 1U
- (in symbol RP2040_C2040) Raspberry Pi

## Library data of the parts
0-10 &gt; &lt; &quot; - ; ? [ \ ] A B BACKSPACE C CAPS D DEL DOWN E ENTER ESC F F1-F12 FN G H I J K L LALT LCTRL LEFT LSHIFT LWIN M MOD1-MOD4 N O P Q R RALT RCTRL RIGHT RSHIFT S SPACE T TAB U UP V W X Y Z ~ = CHERRY-MX-SW-1U: Manufacturer Part: MX-SWITCH?; Add into BOM: yes; Symbol: CHERRY-MX-SW-1U; Device: CHERRY-MX-SW-1U; Supplier: CHERRY; Convert to PCB: yes; Origin Footprint: CHERRY-MX-PCB-1U
BOOTSEL RST = TS-1088-AR02016: Manufacturer: XUNPU(讯普); Add into BOM: yes; Contact Current: 50mA; Voltage Rating (DC): 12V; Insulation Resistance: 100MΩ; Circuit: SPST; Actuator Style: Round Button; Actuator/Cap Color: Black; Operating Force: 160gf@±50gf; Mechanical Life: 100000; Pin Style: SMDSplicing; Switch Length: 4mm; Switch Width: 3mm; Switch Height: 2mm; Strike Gundam: NO; Symbol: TS-1088-AR02016; Device: TS-1088-AR02016; LCSC Part Name: 3x4x2.0 160gf 贴片无柱轻触开关; Supplier Part: C720477; Manufacturer Part: TS-1088-AR02016; Supplier Footprint: SMD; Datasheet: https://atta.szlcsc.com/upload/public/pdf/source/20200810/C720475_60D09DD6C54279ADDB2DC25100F1CC11.pdf; Supplier: LCSC; Convert to PCB: yes; Mounting Style: Brick nogging; Operating Temperature: -30℃~+80℃
C16 C17 = CL05A105KA5NQNC: Manufacturer: SAMSUNG(三星); Add into BOM: yes; Tolerance: ±10%; Symbol: CL05A105KA5NQNC; Device: CL05A105KA5NQNC; LCSC Part Name: 1uF ±10% 25V; Supplier Part: C52923; Manufacturer Part: CL05A105KA5NQNC; Supplier Footprint: 0402; JLCPCB Part Class: Basic Part; Datasheet: https://atta.szlcsc.com/upload/public/pdf/source/20160218/1457707763339.pdf; Supplier: LCSC; Convert to PCB: yes; Value: 1uF
C18 C23 C25-C28 C31 C32 = CL05B104KO5NNNC: Manufacturer: SAMSUNG(三星); Add into BOM: yes; Tolerance: ±10%; Symbol: CL05B104KO5NNNC; Device: CL05B104KO5NNNC; Supplier: LCSC; Manufacturer Part: CL05B104KO5NNNC; Value: 100nF; Supplier Part: C1525; JLCPCB Part Class: Basic Part; LCSC Part Name: 100nF ±10% 16V; Supplier Footprint: 0402; Datasheet: https://atta.szlcsc.com/upload/public/pdf/source/20160218/1457707763339.pdf; Convert to PCB: yes
C19 C20 = 0402CG330J500NT: Manufacturer: FH(风华); Add into BOM: yes; Tolerance: ±5%; Symbol: 0402CG330J500NT; Device: 0402CG330J500NT; LCSC Part Name: 33pF ±5% 50V; Supplier Part: C1562; Manufacturer Part: 0402CG330J500NT; Supplier Footprint: 0402; JLCPCB Part Class: Basic Part; Datasheet: https://atta.szlcsc.com/upload/public/pdf/source/20200305/C486355_26A10D38EF8C2A5C37091D0039909270.pdf; Supplier: LCSC; Convert to PCB: yes; Value: 33pF
C21 C22 = CL05A106MQ5NUNC: Manufacturer: SAMSUNG(三星); Add into BOM: yes; Tolerance: ±20%; Symbol: CL05A106MQ5NUNC; Device: CL05A106MQ5NUNC; Supplier: LCSC; Manufacturer Part: CL05A106MQ5NUNC; Value: 10uF; Supplier Part: C15525; LCSC Part Name: 10uF ±20% 6.3V; Supplier Footprint: 0402; Datasheet: https://atta.szlcsc.com/upload/public/pdf/source/20220823/2B02EE04F8F211D38A52DCB16EB6BEBA.pdf; Convert to PCB: yes
D1-D82 = 1N4148_C14538: Manufacturer: ST(先科); Manufacturer Part: 1N4148; 3DModel: DO-35_D1.9-L3.9-P8.2; Add into BOM: yes; Symbol: 1N4148_C14538; Device: 1N4148_C14538; link: https://item.szlcsc.com/86229.html; Supplier: LCSC; JLCPCB Part Class: Extended Part; Convert to PCB: yes; Origin Footprint: DO-35_BD2.0-L4.2-P8.20-D0.5-RD
  D1-D56 D58-D82: Supplier Part: C14538
I2C#1-I2C#3 = PZ254V-11-04P: Manufacturer: XFCN(兴飞); Symbol: PZ254V-11-04P_C2691448; Add into BOM: yes; Pin Structure: 1x4P; Pitch: 2.54mm; Circluar Pins/Square Pins: Square Pins; Current Rating (Max): 3A; Voltage Rating (Max): 250V; Device: PZ254V-11-04P; Supplier: LCSC; Supplier Part: C2691448; Manufacturer Part: PZ254V-11-04P; JLCPCB Part Class: Extended Part; LCSC Part Name: 间距:2.54mm 1x4P 直插 方针; Supplier Footprint: 插件,P=2.54mm; Datasheet: https://atta.szlcsc.com/upload/public/pdf/source/20200309/C492403_F9F19131791D08044AD4F84F8E751A34.pdf; Convert to PCB: yes; Row Spacing: -; Mounting Type: Straight; Number of Rows: Plugin; Number of Pins: 4P; Length of Mating Pin: 6mm; Insulation Height: 2.5mm; Length of End Connection Pin: 3mm; Operating Temperature Range: -40℃~+105℃; Color: Black
R6 R8-R12 = RC0603FR-0710KL: Manufacturer: YAGEO(国巨); Add into BOM: yes; Tolerance: ±1%; Temperature Coefficient: ±100ppm/℃; Symbol: RC0603FR-0710KL; Device: RC0603FR-0710KL; LCSC Part Name: 10kΩ ±1% 100mW; Supplier Part: C98220; Manufacturer Part: RC0603FR-0710KL; Supplier Footprint: 0603; Datasheet: https://atta.szlcsc.com/upload/public/pdf/source/20170522/1495423494387.pdf; Supplier: LCSC; Convert to PCB: yes; Type: Thick Film Resistors; Value: 10kΩ; Operating Temperature Range: -55℃~+155℃
R13 R14 = 0402WGF220JTCE: Manufacturer: UNI-ROYAL(厚声); Add into BOM: yes; Tolerance: ±1%; Temperature Coefficient: ±100ppm/℃; Symbol: 0402WGF220JTCE; Device: 0402WGF220JTCE; Supplier: LCSC; Manufacturer Part: 0402WGF220JTCE; Supplier Part: C25092; Value: 22Ω; JLCPCB Part Class: Basic Part; LCSC Part Name: 22Ω ±1% 62.5mW 厚膜电阻; Supplier Footprint: 0402; Datasheet: https://atta.szlcsc.com/upload/public/pdf/source/20200306/C422600_1E6D84923E4A46A82E41ADD87F860B5C.pdf; Convert to PCB: yes; Type: Thick Film Resistors; Operating Temperature Range: -55℃~+155℃
R15 R16 R18 = 0402WGF1001TCE: Manufacturer: UNI-ROYAL(厚声); Add into BOM: yes; Tolerance: ±1%; Temperature Coefficient: ±100ppm/℃; Symbol: 0402WGF1001TCE; Device: 0402WGF1001TCE; Supplier: LCSC; Manufacturer Part: 0402WGF1001TCE; Supplier Part: C11702; Value: 1kΩ; JLCPCB Part Class: Basic Part; LCSC Part Name: 1kΩ ±1% 62.5mW 厚膜电阻; Supplier Footprint: 0402; Datasheet: https://atta.szlcsc.com/upload/public/pdf/source/20200306/C422600_1E6D84923E4A46A82E41ADD87F860B5C.pdf; Convert to PCB: yes; Type: Thick Film Resistors; Operating Temperature Range: -55℃~+155℃
R17 = 0402WGF1002TCE: Manufacturer: UNI-ROYAL(厚声); Add into BOM: yes; Tolerance: ±1%; Temperature Coefficient: ±100ppm/℃; Symbol: 0402WGF1002TCE; Device: 0402WGF1002TCE; Supplier: LCSC; Manufacturer Part: 0402WGF1002TCE; Supplier Part: C25744; Value: 10kΩ; JLCPCB Part Class: Basic Part; LCSC Part Name: 10kΩ ±1% 62.5mW 厚膜电阻; Supplier Footprint: 0402; Datasheet: https://atta.szlcsc.com/upload/public/pdf/source/20200306/C422600_1E6D84923E4A46A82E41ADD87F860B5C.pdf; Convert to PCB: yes; Type: Thick Film Resistors; Operating Temperature Range: -55℃~+155℃
R21 R22 = 0402WGF5101TCE: Manufacturer: UNI-ROYAL(厚声); Add into BOM: yes; Tolerance: ±1%; Temperature Coefficient: ±100ppm/℃; Symbol: 0402WGF5101TCE; Device: 0402WGF5101TCE; Supplier: LCSC; Manufacturer Part: 0402WGF5101TCE; Supplier Part: C25905; Value: 5.1kΩ; JLCPCB Part Class: Basic Part; LCSC Part Name: 5.1kΩ ±1% 62.5mW 厚膜电阻; Supplier Footprint: 0402; Datasheet: https://atta.szlcsc.com/upload/public/pdf/source/20200306/C422600_1E6D84923E4A46A82E41ADD87F860B5C.pdf; Convert to PCB: yes; Type: Thick Film Resistors; Operating Temperature Range: -55℃~+155℃
SW1-SW82 = SW-5: Add into BOM: yes; Symbol: SW-5; Device: SW-5; LCSC Part Name: SW-5; Supplier Part: C9900019772; Manufacturer Part: SW-5; Supplier Footprint: KAILH SOCKET; Supplier: LCSC; Convert to PCB: yes
U1 = RP2040_C2040: Manufacturer: Raspberry Pi(树莓派); Add into BOM: yes; CPU Core: ARM Cortex-M0; CPU Maximum Speed: 133MHz; RAM Size: 264KB; GPIO Ports Number: 30; ADC (Bit): 12bit; UART/USART: 2; Universal Serial Bus: 有; Peripheral/Function: DMA；PWM; Symbol: RP2040; Device: RP2040_C2040; LCSC Part Name: ARM Cortex-M0 133MHz; Supplier Part: C2040; Manufacturer Part: RP2040; Supplier Footprint: LQFN-56(7x7); Datasheet: https://atta.szlcsc.com/upload/public/pdf/source/20210621/C2040_96F425825606B7957D87DD32E2512CA9.pdf; Supplier: LCSC; Convert to PCB: yes; Operating Voltage Range: -; Program Storage Size: -; Program Memory Type: -; EEPROM: -; DAC (Bit): -; PWM (Bit): -; 8Bit Timer: -; 16Bit Timer: -; 32Bit Timer: -; CAN: -; I2C: 2; I2S: -; SPI: 2; Internal Comparator: -; communication protocol: -; Watchdog: -; Real-Time Clock: -; Infrared Data Association: -; Low-Voltage Detect: -; CCP Capture/Compare: -; Secure Digital Input and Output: -; Direct Memory Access: 有; Internal Oscillator: -; Operating Temperature Range: -
U2 = AMS1117-3.3_C6186: Manufacturer: AMS; Add into BOM: yes; Output Polarity: Positive; Number of Outputs: 1; Output Voltage: 3.3V~3.3V; Dropout Voltage: 1.3V@(800mA); Output Current: 1A; Power Supply Rejection Ratio (PSRR): 72dB@(120Hz); Symbol: AMS1117-3.3; Device: AMS1117-3.3_C6186; LCSC Part Name: 正 Vout=3.3V 1A 72dB@(120Hz); Supplier Part: C6186; Manufacturer Part: AMS1117-3.3; Supplier Footprint: SOT-223-3; JLCPCB Part Class: Basic Part; Datasheet: https://atta.szlcsc.com/upload/public/pdf/source/20180727/C6186_7A095716F0823C02F1997A905E26C086.pdf; Supplier: LCSC; Convert to PCB: yes; Maximum Input Voltage: -; Quiescent Current (Ground Current): -; Noise: -; Feature: -; Operating Temperature: -
U3 = W25Q128JVSIQ: Manufacturer: WINBOND(华邦); Symbol: W25Q128JVSIQTR; Add into BOM: yes; Device: W25Q128JVSIQ; LCSC Part Name: W25Q128JVSIQ; Supplier Part: C97521; Manufacturer Part: W25Q128JVSIQ; Supplier Footprint: SOIC-8-208mil; Datasheet: https://atta.szlcsc.com/upload/public/pdf/source/20170316/1489627409956.pdf; Supplier: LCSC; Convert to PCB: yes
U4 = GT-USB-7010ASV: Manufacturer: G-Switch(品赞); Add into BOM: yes; Connector Type: Type-C; Gender: Female; Number of Ports: 1; Number of Contacts: 16P; Current Rating - Power (Max): 3A; Soldering Temperature(Max): 260℃; Symbol: GT-USB-7010ASV; Device: GT-USB-7010ASV; LCSC Part Name: Type-C 母 卧贴; Supplier Part: C2988369; Manufacturer Part: GT-USB-7010ASV; Supplier Footprint: SMD; JLCPCB Part Class: Extended Part; Datasheet: https://atta.szlcsc.com/upload/public/pdf/source/20230327/DF227B64686AC8FA0AD1775797F2C3F1.pdf; Supplier: LCSC; Convert to PCB: yes; Standard: USB 2.0; Mounting Style: 卧贴; Contact Material: 高导铜; Contact Plating: Gold; Operating Temperature Range: -40℃~+85℃
X1 = X322512MSB4SI: Manufacturer: YXC(扬兴晶振); Add into BOM: yes; Crystal Type: 贴片晶振; Normal temperature Frequency Tolerance: ±10ppm; Frequency Stability(Full temperature range): ±20ppm; Symbol: X322512MSB4SI; Device: X322512MSB4SI; LCSC Part Name: 12MHz ±10ppm 20pF; Supplier Part: C9002; Manufacturer Part: X322512MSB4SI; Supplier Footprint: SMD3225-4P; JLCPCB Part Class: Basic Part; Datasheet: https://atta.szlcsc.com/upload/public/pdf/source/20240329/19D5F850207469550BEB00D7DFEDBC7A.pdf; Supplier: LCSC; Convert to PCB: yes; Value: 12MHz